# EAGLE design petdisk_max_dip (EAGLE 9.6.1)
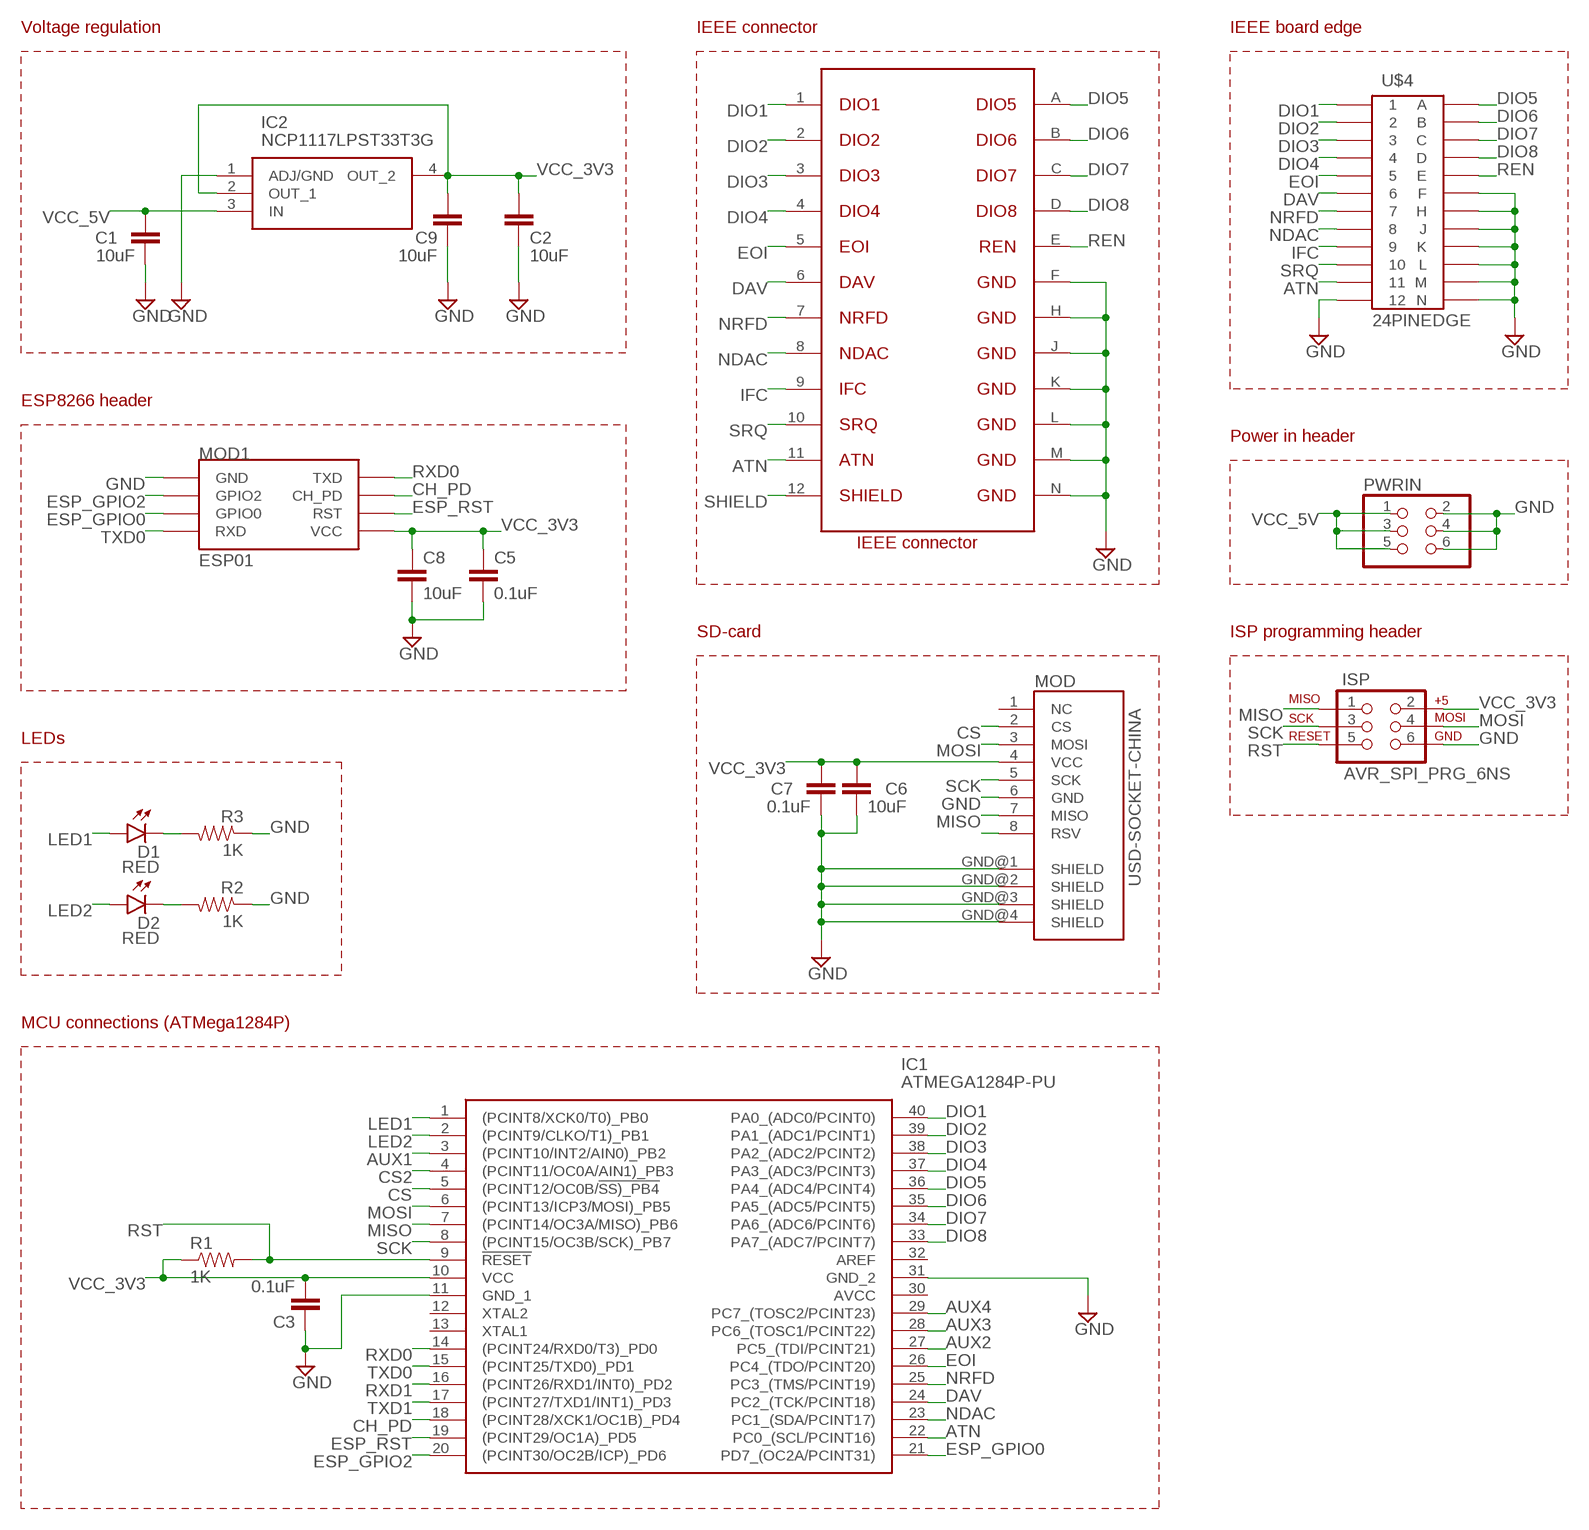
[diagram p0: schematic, sheet 1]

## Parts
C1  10uF  10UF-6.3V-20%(1206)  [1206]
C2  10uF  10UF-6.3V-20%(1206)  [1206]
C3  0.1uF  0.1UF-25V-5%(0603)  [0603-CAP]
C5  0.1uF  0.1UF-25V-5%(0603)  [0603-CAP]
C6  10uF  10UF-6.3V-20%(1206)  [1206]
C7  0.1uF  0.1UF-25V-5%(0603)  [0603-CAP]
C8  10uF  10UF-6.3V-20%(1206)  [1206]
C9  10uF  10UF-6.3V-20%(1206)  [1206]
D1  RED  LED-RED0603  [LED-0603]
D2  RED  LED-RED0603  [LED-0603]
IC1  ATMEGA1284P-PU  [DIP1543W58P254L5175H635Q40N]
IC2  NCP1117LPST33T3G  [SOT230P700X180-4N]
ISP  AVR_SPI_PRG_6NS  [2X3-NS]
MOD  USD-SOCKET-CHINA  [USD-SOCKET-PP]
MOD1  ESP01  [ESP01]
PWRIN  PINHD-2X03_2.54  [2X03]
R1  1K  1KOHM-1/10W-1%(0603)  [0603-RES]
R2  1K  1KOHM-1/10W-1%(0603)  [0603-RES]
R3  1K  1KOHM-1/10W-1%(0603)  [0603-RES]
U$1  CBM_IEEE_CONN  [UPS24CONN]
U$4  24PINEDGE  [24PINEDGE]

## Nets
ATN: IC1.22(PC0_(SCL/PCINT16)) U$1.11 U$4.11
AUX1: IC1.3((PCINT10/INT2/AIN0)_PB2)
AUX2: IC1.27(PC5_(TDI/PCINT21))
AUX3: IC1.28(PC6_(TOSC1/PCINT22))
AUX4: IC1.29(PC7_(TOSC2/PCINT23))
CH_PD: IC1.18((PCINT28/XCK1/OC1B)_PD4) MOD1.CH_PD
CS: IC1.5((PCINT12/OC0B/!SS)_PB4) MOD.2(CS)
CS2: IC1.4((PCINT11/OC0A/AIN1)_PB3)
DAV: IC1.24(PC2_(TCK/PCINT18)) U$1.6 U$4.6
DIO1: IC1.40(PA0_(ADC0/PCINT0)) U$1.1 U$4.1
DIO2: IC1.39(PA1_(ADC1/PCINT1)) U$1.2 U$4.2
DIO3: IC1.38(PA2_(ADC2/PCINT2)) U$1.3 U$4.3
DIO4: IC1.37(PA3_(ADC3/PCINT3)) U$1.4 U$4.4
DIO5: IC1.36(PA4_(ADC4/PCINT4)) U$1.A U$4.A
DIO6: IC1.35(PA5_(ADC5/PCINT5)) U$1.B U$4.B
DIO7: IC1.34(PA6_(ADC6/PCINT6)) U$1.C U$4.C
DIO8: IC1.33(PA7_(ADC7/PCINT7)) U$1.D U$4.D
EOI: IC1.26(PC4_(TDO/PCINT20)) U$1.5 U$4.5
ESP_GPIO0: IC1.21(PD7_(OC2A/PCINT31)) MOD1.GPIO0
ESP_GPIO2: IC1.20((PCINT30/OC2B/ICP)_PD6) MOD1.GPIO2
ESP_RST: IC1.19((PCINT29/OC1A)_PD5) MOD1.RST
GND: C1.2 C2.2 C3.1 C5.2 C6.2 C7.2 C8.2 C9.2 IC1.11(GND_1) IC1.31(GND_2) IC2.1(ADJ/GND) ISP.6 MOD1.GND MOD.6(GND) MOD.GND@1(SHIELD) MOD.GND@2(SHIELD) MOD.GND@3(SHIELD) MOD.GND@4(SHIELD) PWRIN.2 PWRIN.4 PWRIN.6 R2.1 R3.1 U$1.F U$1.H U$1.J U$1.K U$1.L U$1.M U$1.N U$4.12 U$4.F U$4.H U$4.J U$4.K U$4.L U$4.M U$4.N
IFC: U$1.9 U$4.9
LED1: D1.A IC1.1((PCINT8/XCK0/T0)_PB0)
LED2: D2.A IC1.2((PCINT9/CLKO/T1)_PB1)
MISO: IC1.7((PCINT14/OC3A/MISO)_PB6) ISP.1 MOD.7(MISO)
MOSI: IC1.6((PCINT13/ICP3/MOSI)_PB5) ISP.4 MOD.3(MOSI)
N$5: D1.C R3.2
N$6: D2.C R2.2
N$8: MOD.8(RSV)
NDAC: IC1.23(PC1_(SDA/PCINT17)) U$1.8 U$4.8
NRFD: IC1.25(PC3_(TMS/PCINT19)) U$1.7 U$4.7
REN: U$1.E U$4.E
RST: IC1.9(!RESET) ISP.5 R1.2
RXD0: IC1.14((PCINT24/RXD0/T3)_PD0) MOD1.TX(TXD)
RXD1: IC1.16((PCINT26/RXD1/INT0)_PD2)
SCK: IC1.8((PCINT15/OC3B/SCK)_PB7) ISP.3 MOD.5(SCK)
SHIELD: U$1.12
SRQ: U$1.10 U$4.10
TXD0: IC1.15((PCINT25/TXD0)_PD1) MOD1.RX(RXD)
TXD1: IC1.17((PCINT27/TXD1/INT1)_PD3)
VCC_3V3: C2.1 C3.2 C5.1 C6.1 C7.1 C8.1 C9.1 IC1.10(VCC) IC2.2(OUT_1) IC2.4(OUT_2) ISP.2 MOD1.VCC MOD.4(VCC) R1.1
VCC_5V: C1.1 IC2.3(IN) PWRIN.1 PWRIN.3 PWRIN.5
Unconnected: IC1.12(XTAL2) IC1.13(XTAL1) IC1.30(AVCC) IC1.32(AREF) MOD.1(NC)

## Notes on the sheet
- Voltage regulation | IEEE connector | IEEE board edge
- ESP8266 header
- Power in header
- SD-card | ISP programming header
- LEDs
- MCU connections (ATMega1284P)

## Library data of the parts
C1 C2 C6 C8 C9 = SparkFun-Capacitors:10UF-6.3V-20%(1206): CAP-10057 Ceramic; PROD_ID: CAP-10057
C3 C5 C7 = SparkFun-Capacitors:0.1UF-25V-5%(0603): CAP-08604; PROD_ID: CAP-08604
D1 D2 = SparkFun-LED:LED-RED: Assorted Red LEDs LilyPad 1206- DIO-09912 1206- DIO-00809 0603- DIO-00819 "SMART" means more efficient and expensive; PROD_ID: DIO-00819
IC1 = rakettitiede:ATMEGA1284P-PU: ATMEGA1284P-PU, 8 bit AVR Microcontroller 20MHz 128 kB, 4 kB Flash, 16 kB RAM, I2C 40-Pin PDIP Source: Datasheet <http://www.atmel.com/images/atmel-8272-8-bit-avr-microcontroller-atmega164a_pa-324a_pa-644a_pa-1284_p_summary.pdf>; ARROW_PART_NUMBER: ATMEGA1284P-PU; ARROW_PRICE-STOCK: https://www.arrow.com/en/products/atmega1284p-pu/microchip-technology?region=nac; DESCRIPTION: ATMEGA1284P-PU, 8 bit AVR Microcontroller 20MHz 128 kB, 4 kB Flash, 16 kB RAM, I2C 40-Pin PDIP; HEIGHT: 6.35mm; MANUFACTURER_NAME: Microchip; MANUFACTURER_PART_NUMBER: ATMEGA1284P-PU; MOUSER_PART_NUMBER: 556-ATMEGA1284P-PU; MOUSER_PRICE-STOCK: https://www.mouser.co.uk/ProductDetail/Microchip-Technology-Atmel/ATMEGA1284P-PU?qs=K8BHR703ZXgaD0L1rKdwiQ%3D%3D
IC2 = rakettitiede:NCP1117LPST33T3G: Source: Datasheet <http://www.onsemi.com/pub/Collateral/NCP1117LP-D.PDF>; ALLIED_NUMBER: 70466897; ALLIED_PRICE-STOCK: http://www.alliedelec.com/on-semiconductor-ncp1117lpst33t3g/70466897/; HEIGHT: 1.8mm; MANUFACTURER_NAME: ON Semiconductor; MANUFACTURER_PART_NUMBER: NCP1117LPST33T3G; MOUSER_PART_NUMBER: 863-NCP1117LPST33T3G; MOUSER_PRICE-STOCK: https://www.mouser.com/Search/Refine.aspx?Keyword=863-NCP1117LPST33T3G; RS_PART_NUMBER: 8022137P; RS_PRICE-STOCK: http://uk.rs-online.com/web/p/products/8022137P
ISP = SparkFun-Connectors:AVR_SPI_PRG_6: AVR ISP 6 Pin This is the reduced ISP connector for AVR programming. Common on Arduino. This footprint will take up less PCB space and can be used with a 10-pin to 6-pin adapter such as SKU: BOB-08508 **Special note about "TEST_POINT" package. The stop mask is on the top side, so if you want your programming test points to be on the bottom of your board, make sure to place this package on the bottom side of the board. This also ensure that the orientation to program from the bottom side will be correct.
MOD = BaseApp:USD-SOCKET-CHINA
MOD1 = esp8266:ESP01: ESP8266 Wifi module 01
PWRIN = pinhead-2:PINHD-2X03: PIN HEADER
R1-R3 = SparkFun-Resistors:1KOHM-1/10W-1%(0603): RES-07856; PROD_ID: RES-07856
U$1 = commodore:CBM_IEEE_CONN
U$4 = commodore:24PINEDGE

## Board
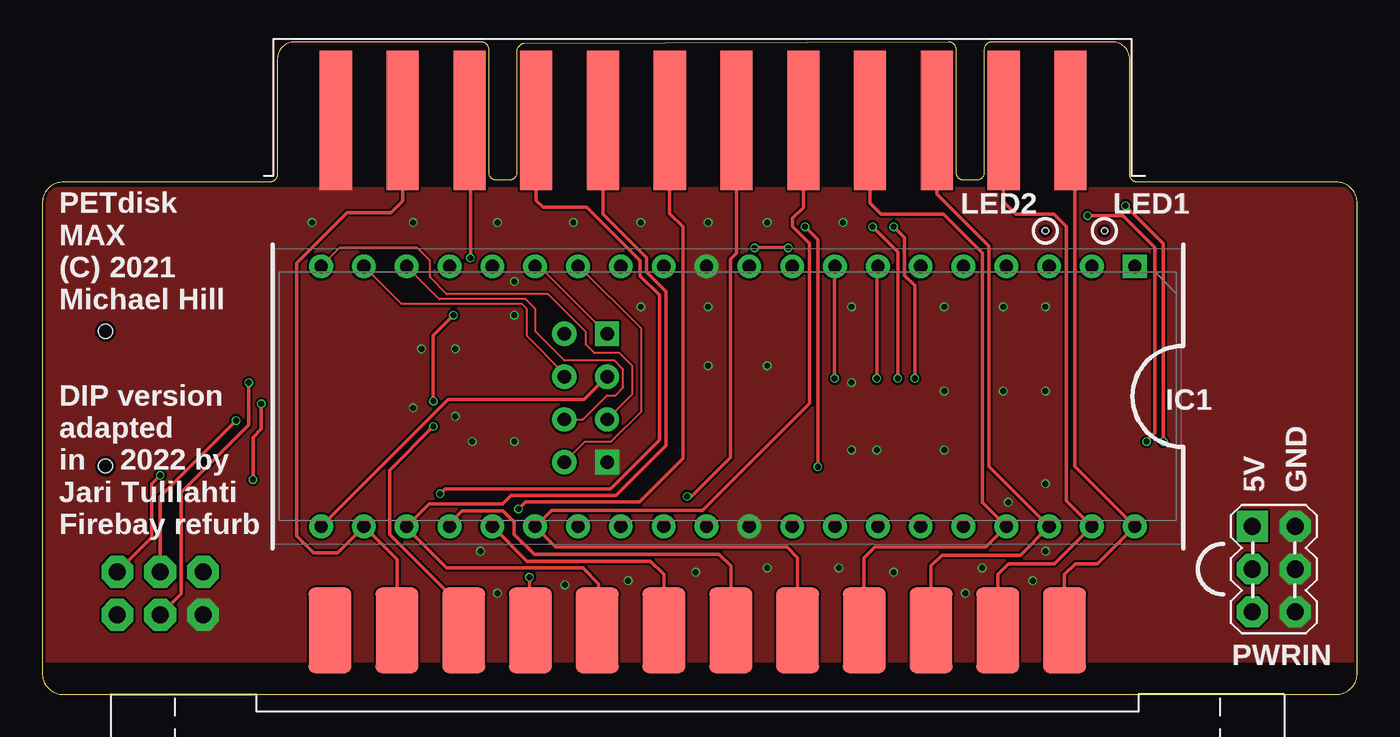
[diagram p1: board, top side]
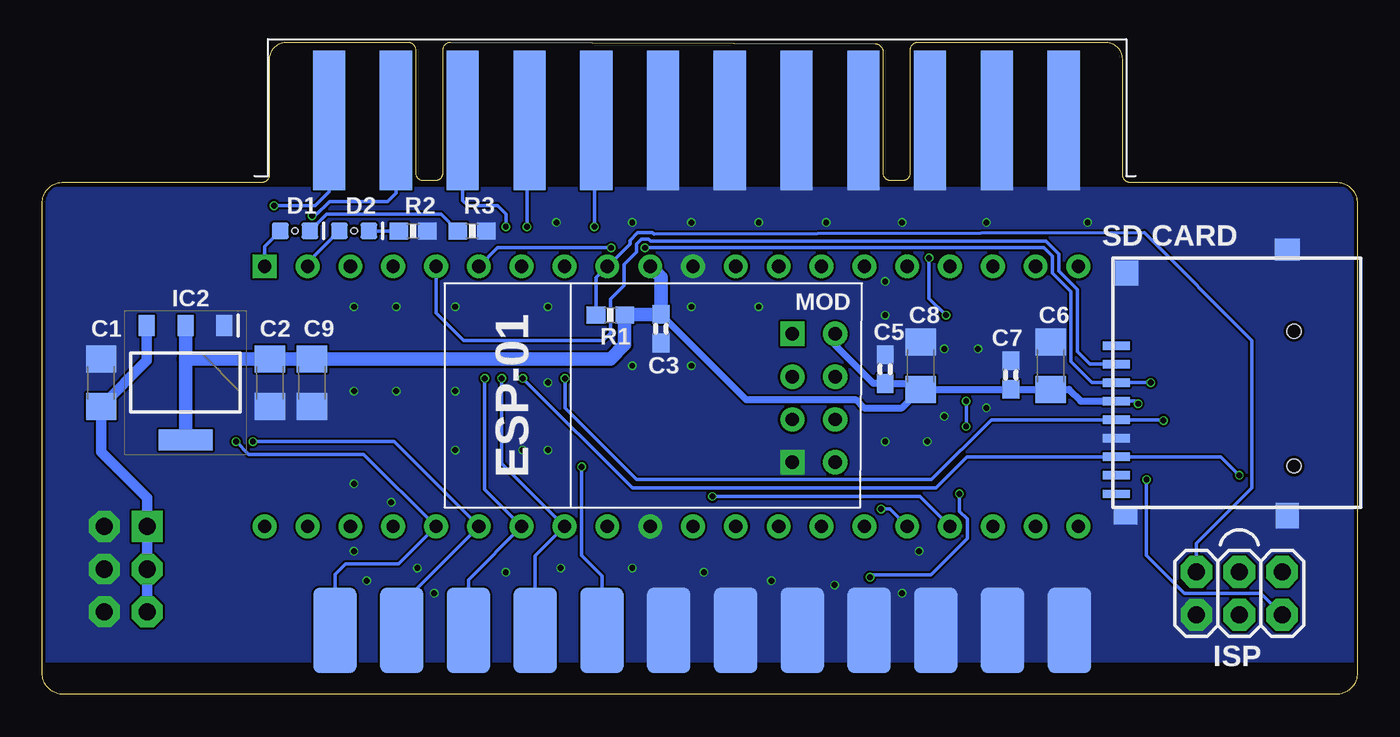
[diagram p2: board, bottom side, seen from below]

Size 78 x 38.7 mm. Coordinates in mm from the lower left corner, seen from the top.
Outline: 0,29.13 0,1.27 arc90 1.27,0 76.73,0 arc90 78,1.27 78,29.13 arc90 76.73,30.4 64.95,30.4 arc-90 64.5,30.85 64.5,37.7 arc90 63.5,38.7 56.31,38.7 arc90 55.86,38.25 55.86,30.95 arc-90 55.41,30.5 54.67,30.5 arc-90 54.22,30.95 54.22,38.25 arc90 53.77,38.7 28.59,38.6 arc90 28.14,38.15 28.14,30.95 arc-90 27.69,30.5 26.95,30.5 arc-90 26.5,30.95 26.5,38.25 arc90 26.05,38.7 14.95,38.7 arc90 13.95,37.7 13.95,30.85 arc-90 13.5,30.4 1.27,30.4 arc90 0,29.13
Copper layers (1*16): Top 0.035mm / dielectric 1.6mm / Bottom 0.035mm
Design rules "jlcpcb-2layers": minimum track width 5mil, minimum drill 0.3mm, track to track 5mil, track to pad 5mil, pad to pad 5mil, via to via 5mil, smd to smd 5mil, copper to edge 0.2mm, drill to drill 6mil, minimum pad ring 10mil, minimum via ring 3mil, stop-mask expansion 4mil, vias tented up to drill 0mil, thermal gap 10mil
Holes 0.35 mm at 59.5,27.5 63,27.5

### Footprints (pad centres in the part's own frame; a part is rotated, then mirrored left to right if it is on the bottom)
1206 = smd 1.6 x 1.8: 1 -1.4,0; 2 1.4,0
0603-CAP = smd 1.1 x 1: 1 -0.85,0; 2 0.85,0
LED-0603 = smd 1 x 1: A 0,-0.877; C 0,0.877
DIP1543W58P254L5175H635Q40N = drill 0.784 pad 1.184 square: 1 -7.715,24.13 | drill 0.784 pad 1.184: 2 -7.715,21.59; 3 -7.715,19.05; 4 -7.715,16.51; 5 -7.715,13.97; 6 -7.715,11.43; 7 -7.715,8.89; 8 -7.715,6.35; 9 -7.715,3.81; 10 -7.715,1.27; 11 -7.715,-1.27; 12 -7.715,-3.81; 13 -7.715,-6.35; 14 -7.715,-8.89; 15 -7.715,-11.43; 16 -7.715,-13.97; 17 -7.715,-16.51; 18 -7.715,-19.05; 19 -7.715,-21.59; 20 -7.715,-24.13; 21 7.715,-24.13; 22 7.715,-21.59; 23 7.715,-19.05; 24 7.715,-16.51; 25 7.715,-13.97; 26 7.715,-11.43; 27 7.715,-8.89; 28 7.715,-6.35; 29 7.715,-3.81; 30 7.715,-1.27; 31 7.715,1.27; 32 7.715,3.81; 33 7.715,6.35; 34 7.715,8.89; 35 7.715,11.43; 36 7.715,13.97; 37 7.715,16.51; 38 7.715,19.05; 39 7.715,21.59; 40 7.715,24.13
SOT230P700X180-4N = smd 1.25 x 0.95: 1 -3.4,2.3; 2 -3.4,0; 3 -3.4,-2.3 | smd 1.25 x 3.2: 4 3.4,0
2X3-NS = drill 1.016 pad 1.88 octagon: 1 -2.54,-1.27; 2 -2.54,1.27; 3 0,-1.27; 4 0,1.27; 5 2.54,-1.27; 6 2.54,1.27
USD-SOCKET-PP = smd 0.5 x 1.6: 1 2.2,-1.2; 2 1.1,-1.2; 3 0,-1.2; 4 -1.1,-1.2; 5 -2.2,-1.2; 6 -3.3,-1.2; 7 -4.4,-1.2; 8 -5.5,-1.2; CD1 -6.6,-1.2 | smd 1.5 x 1.35: GND@1 -7.9,-11.35 | smd 1.3 x 1.5: GND@2 7.9,-11.35 | smd 1.5 x 1.5: GND@3 6.5,-1.75 | smd 1 x 1.4: GND@4 -7.9,-1.75 | hole 0.8: -4.95,-11.75; 3.05,-11.75
ESP01 = drill 0.8: CH_PD -1.285,-8.178; GPIO0 1.255,-5.638; GPIO2 -1.285,-5.638; RST 1.255,-8.178; TX -3.825,-8.178; VCC 3.795,-8.178 | drill 0.8 square: GND -3.825,-5.638; RX 3.795,-5.638
2X03 = drill 1.016 square: 1 -2.54,-1.27 | drill 1.016 octagon: 2 -2.54,1.27; 3 0,-1.27; 4 0,1.27; 5 2.54,-1.27; 6 2.54,1.27
0603-RES = smd 1.1 x 1: 1 -0.85,0; 2 0.85,0
UPS24CONN = smd 2.54 x 5.08: 1 -21.779,-1.27; 2 -17.819,-1.27; 3 -13.859,-1.27; 4 -9.899,-1.27; 5 -5.939,-1.27; 6 -1.979,-1.27; 7 1.981,-1.27; 8 5.941,-1.27; 9 9.901,-1.27; 10 13.861,-1.27; 11 17.821,-1.27; 12 21.781,-1.27 | smd 2.54 x 5.08 bottom: A -21.779,-1.27; B -17.819,-1.27; C -13.859,-1.27; D -9.899,-1.27; E -5.939,-1.27; F -1.979,-1.27; H 1.981,-1.27; J 5.941,-1.27; K 9.901,-1.27; L 13.861,-1.27; M 17.821,-1.27; N 21.781,-1.27
24PINEDGE = smd 1.905 x 8.255: 1 -21.78,-0.254; 2 -17.82,-0.254; 3 -13.86,-0.254; 4 -9.9,-0.254; 5 -5.94,-0.254; 6 -1.98,-0.254; 7 1.98,-0.254; 8 5.94,-0.254; 9 9.9,-0.254; 10 13.86,-0.254; 11 17.82,-0.254; 12 21.78,-0.254 | smd 1.905 x 8.255 bottom: A -21.78,-0.254; B -17.82,-0.254; C -13.86,-0.254; D -9.9,-0.254; E -5.94,-0.254; F -1.98,-0.254; H 1.98,-0.254; J 5.94,-0.254; K 9.9,-0.254; L 13.86,-0.254; M 17.82,-0.254; N 21.78,-0.254

### Placement (x,y rotation side)
C1  74.5,18.5 90 bottom
C2  64.5,18.5 270 bottom
C3  41.3,21.7 90 bottom
C5  28,19.3 90 bottom
C6  18.2,19.5 90 bottom
C7  20.55,18.95 90 bottom
C8  25.9,19.5 90 bottom
C9  62,18.5 270 bottom
D1  63,27.5 270 bottom
D2  59.5,27.5 270 bottom
IC1  40.67,17.68 270 top
IC2  69.5,18.5 270 bottom
ISP  7,6 180 bottom
MOD  15.5,18.5 90 bottom
MOD1  39.14,17.6 90 bottom
PWRIN  73.04,7.44 270 top
R1  44.3,22.5 180 bottom
R2  56,27.5 180 bottom
R3  52.5,27.5 180 bottom
U$1  38.86,2.54 180 top
U$4  39.2,33.8 180 top

### Tracks (layer width: path | path; a pad name or v marks a point on that pad's centre or on a via)
ATN
  Top 0.203: U$1.11 21.04,8.01 IC1.22 17.52,8.4 16.1,8.4 15.1,9.4 15.1,25.6 18.1,28.6 20.7,28.6 21.38,29.28 U$4.11
CH_PD
  Top 0.127: MOD1.CH_PD 32.06,16.31 33.5,17.75 34,17.75 34.46,18.21 34.46,19.29 33.94,19.81 30.98,19.81 29.25,21.54 29.25,22.86 28.66,23.46 23.54,23.46 IC1.18
  Top 0.203: IC1.18
CS
  Bottom 0.203: MOD.2 15.85,19.6 16.61,20.36 16.61,24.02 17.71,25.12 17.71,26.12 18.48,26.89 41.93,26.89 42.04,27 42.46,27 42.76,26.71 42.76,26.25 43.5,25.5 43.5,24.25 44.3,23.45 44.3,21.45 44.75,21 53,21 54.64,22.64 IC1.5
DAV  (via drill 0.35)
  Top 0.203: U$1.6 40.84,7.62 40.15,8.3 29.2,8.3 28,9.5 28,10.25 27.35,10.9 24.9,10.9 24.16,10.16 IC1.24 | U$4.6 41.18,26.2 40.82,25.84 40.82,14.07 38.5,11.75 v38.25,11.75
  Bottom 0.203: IC1.24 25.95,11.75 v38.25,11.75
DIO1
  Top 0.203: U$1.1 60.64,7.12 61.27,7.75 62.59,7.75 IC1.40 61.25,13.52 61.25,33.78 U$4.1
DIO2
  Top 0.203: U$1.2 56.68,7.12 57.31,7.75 60.05,7.75 IC1.39 60.75,11.47 60.75,27.75 60,28.5 57.75,28.5 57,29.25 57,34.03 U$4.2
DIO3
  Top 0.203: U$1.3 52.72,7.62 53.35,8.25 58.01,8.25 IC1.38 56.15,13.54 56.15,26.6 53.06,29.69 U$4.3
DIO4
  Top 0.203: U$1.4 48.75,8.12 49.38,8.75 55.97,8.75 IC1.37 55.75,11.39 55.75,26.2 53.45,28.5 49.75,28.5 49.1,29.15 U$4.4
DIO5  (via drill 0.35)
  Top 0.203: v66.5,15 66.5,26.75 v64.25,29
  Bottom 0.203: U$1.A 60.64,7.12 60,7.75 56.85,7.75 IC1.36 58.92,14.25 65.75,14.25 v66.5,15 | v64.25,29 61.82,29 60.98,29.84 U$4.A
DIO6  (via drill 0.35)
  Top 0.203: v65.5,15 66,15.5 66,26.5 64.1,28.4 v62,28.4
  Bottom 0.203: U$1.B 56.68,5.39 IC1.35 57.13,15 v65.5,15 | v62,28.4 61.8,28.4 60.95,29.25 57.5,29.25 57.02,29.73 U$4.B
DIO7  (via drill 0.35)
  Top 0.203: v51.75,18.75 51.75,24.25 51.15,24.85 51.15,27.1 v50.5,27.75
  Bottom 0.203: U$1.C 52.72,6.81 IC1.34 51.75,12.15 v51.75,18.75 | v50.5,27.75 50.5,28.5 51,29 52.75,29 53.06,29.31 U$4.C
DIO8  (via drill 0.35)
  Top 0.203: v50.75,18.75 50.75,26.25 v49.25,27.75
  Bottom 0.203: U$1.D 48.76,8.23 IC1.33 50.75,13.7 v50.75,18.75 | v49.25,27.75 49.25,33.9 U$4.D
EOI
  Top 0.203: U$1.5 44.8,8.12 44.16,8.75 30.45,8.75 IC1.26 30.2,10.92 39.17,10.92 45.5,17.25 45.5,26.75 44.5,27.75 44.5,28.25 45.14,28.89 U$4.5
ESP_GPIO0
  Top 0.203: IC1.21 24.07,17.5 32.15,17.5 MOD1.GPIO0
ESP_GPIO2
  Top 0.127: MOD1.GPIO2 35,17.81 35,19.5 34.25,20.25 32.75,20.25 32.25,20.75 32.25,21.5 30,23.75 24,23.75 23,24.75 23,25.75 22.25,26.5 17.64,26.5 IC1.20
ESP_RST
  Top 0.127: MOD1.RST 30.96,19.05 28.75,21.27 28.75,22.86 28.45,23.17 21.31,23.17 IC1.19
GND  (via drill 0.35)
  other vias: 22,28 27,28 31.5,28 35.5,28 39.5,28 43,28 43,19.5 39.5,19.5 39.5,23 35.5,23 28,24.5 28,22.5 24.5,20.5 22.5,20.5 24.5,16.5 22,17 28,15 25.5,15 47.5,28 48,23 48,18.5 48,14.5 49.5,14.5 53.5,14.5 53.5,18 53.5,23 57,23 59.5,23 59.5,18 57,18 59.5,12.5 59.5,8.5 57.3,11.4 26,8.5 16,28 43,7.5 38.75,7.25 34.75,6.75 31,6.5 27,6 58.75,6.75 54.75,6 50.5,7.25 55.75,7.5 47.25,7.5
  pour Top (no thermals): 0,2 78,2 78,30 0,30
  pour Bottom (no thermals): 0,2 78,2 78,30 0,30
IFC  (via drill 0.35)
  Top 0.203: U$4.9 29.3,33.7 29.3,31.9 29.3,29.3 29.7,28.9 32.3,28.9 35.45,25.75 35.45,24.83 36.6,23.68 36.6,15.1 33.7,12.2 23.9,12.2 v23.6,11.9 | v28.9,6.95 28.9,3.87 U$1.9
  Bottom 0.203: v23.6,11.9 23.6,10.87 23.14,10.4 23.14,9.26 25.3,7.1 28.75,7.1 v28.9,6.95
LED1
  Bottom 0.203: IC1.1 64.8,26.58 D1.A
LED2
  Bottom 0.203: D2.A 62.26,25.62 IC1.2
MISO  (via drill 0.35)
  Top 0.203: ISP.1 6.5,9.31 6.5,12.5 v7,13 | v49.5,18.75 49.5,25.34 IC1.7
  Bottom 0.203: v7,13 8.1,14.1 MOD.7 23.15,14.1 25,12.25 38.04,12.25 38.04,12.26 38.46,12.26 38.46,12.25 43,12.25 v49.5,18.75
MOSI  (via drill 0.35)
  Top 0.203: ISP.4 8.25,5.98 8.25,12 12.25,16 v12.25,18.5 | v42.25,26.5 v44.25,26.5
  Bottom 0.203: v12.25,18.5 MOD.3 15.75,18.5 17,19.75 17,23.9 18.1,25 18.1,26 18.6,26.5 v42.25,26.5 | v44.25,26.5 50.99,26.5 IC1.6
N$5
  Bottom 0.203: R3.2 54.35,28.5 61.12,28.5 D1.C
N$6
  Bottom 0.203: R2.2 D2.C
NDAC
  Top 0.203: U$1.8 33,3.89 33,6.57 32.07,7.5 24,7.5 21.62,9.88 IC1.23 22.95,11.3 27.3,11.3 27.81,11.81 34.02,11.81 37,14.79 37,23.89 35.84,25.05 35.84,25.91 33.26,28.49 U$4.8
NRFD  (via drill 0.35)
  Top 0.203: IC1.25 28.77,7.9 36.09,7.9 36.88,7.12 U$1.7 | U$4.7 37.22,28.53 38,27.75 38,14 35.42,11.42 28.67,11.42 v28.25,11
  Bottom 0.203: IC1.25 27.73,11 v28.25,11
REN  (via drill 0.35)
  Top 0.203: v46,13.5 46,27 v45.25,27.75
  Bottom 0.203: U$1.E 44.8,7.05 46,8.25 v46,13.5 | v45.25,27.75 45.25,33.94 U$4.E
RST
  Bottom 0.203: R1.2 45.15,24.73 IC1.9 43.15,26.73 43.15,26.93 42.68,27.4 41.8,27.4 41.7,27.3 12.65,27.4 6.25,21 6.25,12.25 9.54,8.96 ISP.5
RXD0
  Top 0.127: MOD1.TX 32.19,15 33.75,15 35.54,16.79 35.54,21.71 31.86,25.39
  Top 0.203: IC1.14 31.86,25.39
SCK  (via drill 0.35)
  Top 0.203: ISP.3 7,11.75 v11.5,16.25 | v47,18.75 47,25.38 IC1.8
  Bottom 0.203: v11.5,16.25 11.55,16.3 MOD.5 21.7,16.3 25.25,12.75 42.75,12.75 47,17 v47,18.75
SRQ  (via drill 0.35)
  Top 0.203: U$1.10 25,5.1 20.6,9.5 20.6,13.3 v23.2,15.9 | v23.2,17.4 23.2,21.3 v24.4,22.5 | v25.4,25.9 25.4,33.99 U$4.10
  Bottom 0.203: v23.2,15.9 v23.2,17.4 | v24.4,22.5 25.4,23.5 v25.4,25.9
TXD0
  Top 0.127: MOD1.RX 29.5,25.39
  Top 0.203: IC1.15 29.5,25.39
VCC_3V3  (via drill 0.35)
  Top 0.203: v12.5,12.75 12.5,15.25 13,15.75 v13,17.25
  Bottom 0.203: ISP.2 5.73,6 10.25,6 12.5,8.25 v12.5,12.75 | v13,17.25 13.15,17.4 MOD.4
  Bottom 0.406: C8.1 26.25,18.45 C5.1 28.7,18.45 30.96,20.71 MOD1.VCC | C3.2 36.25,17.5 32.25,17.5 29.75,17.5 29.25,17 27,17 C8.1 | C8.1 C7.1 C6.1 17.1,18.1 16.4,17.4 MOD.4
  Bottom 0.8: IC2.2 69.5,19.9 | 69.5,19.9 IC2.4 | 69.5,19.9 C2.1 C9.1 44.3,19.9 43.45,20.75 R1.1 43.4,22.55 C3.2 41.3,24.75 IC1.10
VCC_5V
  Bottom 0.61: PWRIN.5 PWRIN.3 PWRIN.1 71.77,11.67 74.5,14.4 C1.1 71.8,19.8 IC2.3

### Text on the board
tPlace: LED2 | LED1 | 5V | GND | PETdisk / MAX / (C) 2021 / Michael Hill / / / DIP version / adapted / in 2022 by / Jari Tulilahti / Firebay refurb
bPlace: SD CARD